# EAGLE design nixie-frontpanel (EAGLE 6.5.0)
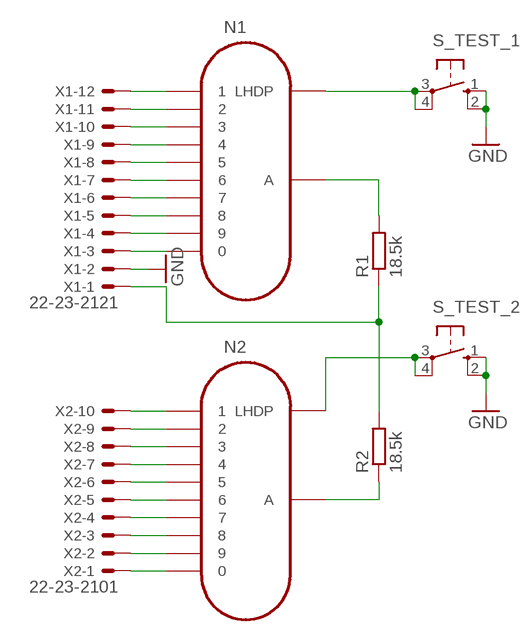
[diagram p0: schematic, sheet 1]

## Parts
N1  IN-12B  [IN-12]
N2  IN-12B  [IN-12]
R1  18.5k  R-EU_M0805  [M0805]
R2  18.5k  R-EU_M0805  [M0805]
S_TEST_1  10-XX  [B3F-10XX]
S_TEST_2  10-XX  [B3F-10XX]
X1  22-23-2121  [22-23-2121]
X2  22-23-2101  [22-23-2101]

## Nets
GND: S_TEST_1.1(S) S_TEST_1.2(S1) S_TEST_2.1(S) S_TEST_2.2(S1) X1.2
N$1: N1.1 X1.12
N$2: N1.2 X1.11
N$3: N1.3 X1.10
N$4: N1.4 X1.9
N$5: N1.5 X1.8
N$6: N1.6 X1.7
N$7: N1.7 X1.6
N$8: N1.8 X1.5
N$9: N1.9 X1.4
N$10: N1.0 X1.3
N$11: N2.1 X2.10
N$12: N2.2 X2.9
N$13: N2.3 X2.8
N$14: N2.4 X2.7
N$15: N2.5 X2.6
N$16: N2.6 X2.5
N$17: N2.7 X2.4
N$18: N2.8 X2.3
N$19: N2.9 X2.2
N$20: N2.0 X2.1
N$21: R1.1 R2.2 X1.1
N$22: N1.A R1.2
N$23: N2.A R2.1
N$24: N1.LHDP S_TEST_1.3(P) S_TEST_1.4(P1)
N$25: N2.LHDP S_TEST_2.3(P) S_TEST_2.4(P1)

## Library data of the parts
N1 N2 = russian-nixies:IN-12B: IN-12B: medium numeric topview nixie tube
R1 R2 = rcl:R-EU_: RESISTOR, European symbol
S_TEST_1 S_TEST_2 = switch-omron:10-XX: OMRON SWITCH; MPN: B3F-1000; OC_FARNELL: 176432; OC_NEWARK: 36M3542
X1 = con-molex:22-23-2121: .100" (2.54mm) Center Header - 12 Pin; MF: MOLEX; MPN: 22-23-2121; OC_FARNELL: 1462935; OC_NEWARK: 56H0456
X2 = con-molex:22-23-2101: .100" (2.54mm) Center Header - 10 Pin; MF: MOLEX; MPN: 22-23-2101; OC_FARNELL: 1756828; OC_NEWARK: 94C0765

## Board
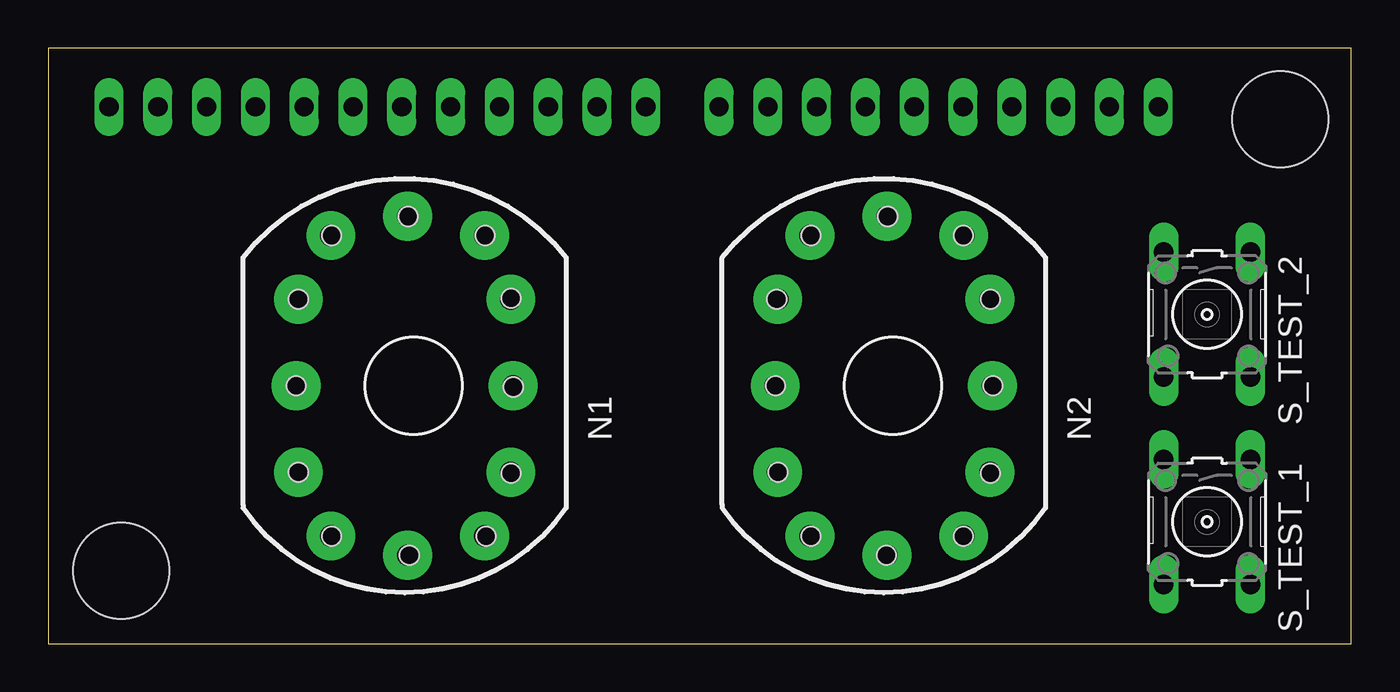
[diagram p1: board, top side]
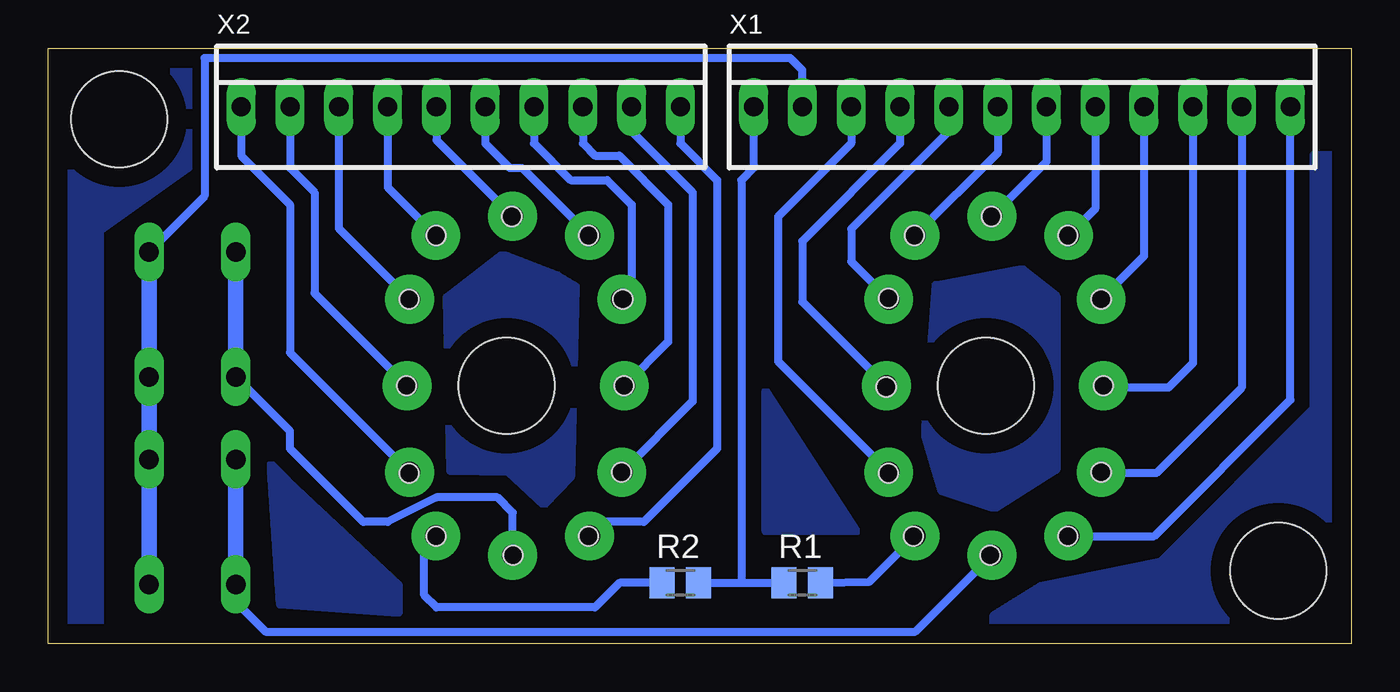
[diagram p2: board, bottom side, seen from below]

Size 67.84 x 31 mm. Coordinates in mm from the lower left corner, seen from the top.
Outline: 0,0 67.84,0 67.84,31 0,31 0,0
Copper layers (1*16): Top 0.035mm / dielectric 1.5mm / Bottom 0.035mm
Design rules "default": minimum track width 10mil, minimum drill 24mil, track to track 8mil, track to pad 8mil, pad to pad 8mil, via to via 8mil, smd to smd 8mil, copper to edge 40mil, drill to drill 8mil, minimum pad ring 10mil, minimum via ring 8mil, stop-mask expansion 4mil, vias tented up to drill 0mil, thermal gap 10mil
Holes 5 mm at 3.81,3.81 64.14,27.3
Holes 1 mm at 14.75,21.25 18.75,22.23 22.74,21.25 24.09,17.98 24.22,13.37 24.09,8.87 22.8,5.6 18.81,4.62 14.75,5.6 13.03,8.93 12.91,13.43 13.03,17.92 43.7,22.23 39.71,21.25 47.64,21.25 49.05,17.92 49.17,13.43 49.05,8.87 47.64,5.6 43.64,4.62 39.71,5.6 37.99,8.93 37.86,13.43 37.92,17.92

### Footprints (pad centres in the part's own frame; a part is rotated, then mirrored left to right if it is on the bottom)
IN-12 = drill 1.1 pad 2.54: 0 5.048,-4.5; 1 -4.317,-7.817; 2 -6,-4.5; 3 -6.127,0; 4 -6,4.5; 5 -4.317,7.817; 6 -0.318,8.818; 7 3.683,7.817; 8 5.048,4.5; 9 5.175,0; A 3.683,-7.817; LHDP -0.318,-8.818 | hole 5: 0,0
M0805 = smd 1.3 x 1.6: 1 -0.95,0; 2 0.95,0
B3F-10XX = drill 1.016 long: 1 -3.251,2.261; 2 3.251,2.261; 3 -3.251,-2.261; 4 3.251,-2.261
22-23-2121 = drill 1 long: 1 -13.97,0; 2 -11.43,0; 3 -8.89,0; 4 -6.35,0; 5 -3.81,0; 6 -1.27,0; 7 1.27,0; 8 3.81,0; 9 6.35,0; 10 8.89,0; 11 11.43,0; 12 13.97,0
22-23-2101 = drill 1 long: 1 -11.43,0; 2 -8.89,0; 3 -6.35,0; 4 -3.81,0; 5 -1.27,0; 6 1.27,0; 7 3.81,0; 8 6.35,0; 9 8.89,0; 10 11.43,0

### Placement (x,y rotation side)
N1  19.04,13.43 0 top
N2  43.98,13.43 0 top
R1  28.57,3.17 0 bottom
R2  34.92,3.17 0 bottom
S_TEST_1  60.33,6.35 270 top
S_TEST_2  60.33,17.14 270 top
X1  17.14,27.94 0 bottom
X2  46.35,27.94 0 bottom

### Tracks (layer width: path | path; a pad name or v marks a point on that pad's centre or on a via)
GND
  Bottom 0.406: X1.2 28.57,29.84 29.21,30.48 59.69,30.48 59.69,23.29 S_TEST_2.1
  Bottom 0.813: S_TEST_2.1 S_TEST_2.2 S_TEST_1.1 S_TEST_1.2
N$1
  Bottom 0.406: N1.1 10.26,5.61 3.17,12.7 X1.12
N$2
  Bottom 0.406: X1.11 5.71,13.34 10.16,8.89 12.99,8.89 N1.2
N$3
  Bottom 0.406: X1.10 8.26,14.61 9.53,13.34 12.81,13.34 N1.3
N$4
  Bottom 0.406: X1.9 10.79,20.17 N1.4
N$5
  Bottom 0.406: X1.8 13.34,22.63 N1.5
N$6
  Bottom 0.406: X1.7 15.88,25.09 N1.6
N$7
  Bottom 0.406: X1.6 18.41,25.55 N1.7
N$8
  Bottom 0.406: X1.5 20.95,26.67 26.04,21.59 26.04,19.88 N1.8
N$9
  Bottom 0.406: X1.4 23.5,26.04 28.57,20.95 28.57,17.8 N1.9
N$10
  Bottom 0.406: X1.3 26.04,26.04 29.84,22.23 29.84,14.69 N1.0
N$11
  Bottom 0.406: X2.10 34.92,26.04 33.02,24.13 33.02,10.16 36.83,6.35 38.92,6.35 N2.1
N$12
  Bottom 0.406: X2.9 37.47,26.67 34.29,23.5 34.29,12.62 N2.2
N$13
  Bottom 0.406: X2.8 40.01,26.04 39.37,25.4 38.1,25.4 35.56,22.86 35.56,15.72 N2.3
N$14
  Bottom 0.406: X2.7 42.55,26.04 40.64,24.13 38.73,24.13 37.47,22.86 37.47,18.44 N2.4
N$15
  Bottom 0.406: X2.6 45.09,26.04 43.81,24.77 43.17,24.77 N2.5
N$16
  Bottom 0.406: X2.5 47.62,26.21 N2.6
N$17
  Bottom 0.406: X2.4 50.16,23.75 N2.7
N$18
  Bottom 0.406: X2.3 52.7,21.61 N2.8
N$19
  Bottom 0.406: X2.2 55.24,24.77 53.98,23.5 53.98,18.26 N2.9
N$20
  Bottom 0.406: X2.1 57.78,25.4 55.24,22.86 55.24,15.15 N2.0
N$21
  Bottom 0.406: X1.1 31.11,24.77 31.75,24.13 31.75,3.17 | R2.2 31.75,3.17 | 31.75,3.17 R1.1
N$22
  Bottom 0.406: R1.2 25.09,3.25 N1.A
N$23
  Bottom 0.406: R2.1 38.1,3.17 39.37,1.91 47.62,1.91 48.26,2.54 48.26,5.01 N2.A
N$24
  Bottom 0.406: S_TEST_1.4 58.06,2.18 56.52,0.64 22.7,0.64 N1.LHDP
  Bottom 0.813: S_TEST_1.3 S_TEST_1.4
N$25
  Bottom 0.406: N2.LHDP 43.66,6.83 44.45,7.62 47.62,7.62 50.16,6.35 51.44,6.35 55.24,10.16 55.24,11.07 S_TEST_2.4
  Bottom 0.813: S_TEST_2.3 S_TEST_2.4
N$26
  pour Bottom: 0.43,0.55 18.62,0.55 18.62,1.48 16.17,3.02 9.9,4.31 1.97,12.26 1.97,25.44 0.12,25.44 0.12,0.49
N$27
  pour Bottom: 60.54,30.43 60.54,24.76 65.15,21.49 65.15,0.49 67.67,0.49 67.73,30.61 60.6,30.61
N$28
  pour Bottom: 55.38,8.5 49.6,3.08 49.6,1.6 55.75,2.03 56.24,9.36
N$29
  pour Bottom: 25.75,5.85 30.49,5.85 30.49,13.18
N$30
  pour Bottom: 17.15,19.52 15.37,18.11 15.37,9.05 18.56,7.02 21.33,7.95 22.19,10.9 21.64,18.66
N$31
  pour Bottom: 40.38,18.6 40.63,8.68 42.04,7.21 43.89,8.93 46.9,8.99 47.08,18.05 44.19,20.26 41.3,19.15